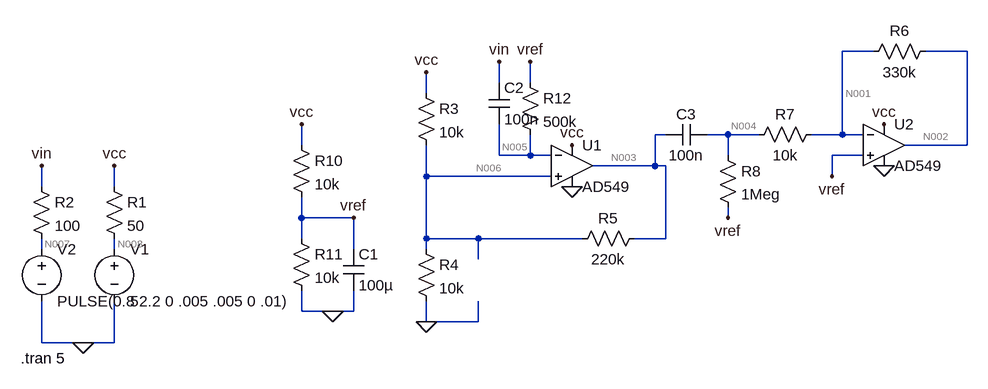
[diagram p0: schematic smith-trig.asc]
smith-trig.asc, the LTspice schematic file:
Version 4
SHEET 1 880 680
WIRE 608 -16 560 -16
WIRE 752 -16 688 -16
WIRE 32 32 32 0
WIRE 80 32 80 0
WIRE -80 48 -80 16
WIRE 288 112 272 112
WIRE 384 112 352 112
WIRE 432 112 384 112
WIRE 560 112 560 -16
WIRE 560 112 512 112
WIRE 592 112 560 112
WIRE -272 128 -272 96
WIRE 752 128 752 -16
WIRE 752 128 656 128
WIRE 32 144 32 96
WIRE 80 144 80 112
WIRE 80 144 32 144
WIRE 112 144 80 144
WIRE 384 144 384 112
WIRE 592 144 544 144
WIRE 272 160 272 112
WIRE 272 160 176 160
WIRE 288 160 272 160
WIRE -80 176 -80 128
WIRE 112 176 -80 176
WIRE 544 176 544 144
WIRE -672 192 -672 160
WIRE -560 192 -560 160
WIRE -272 240 -272 208
WIRE -192 240 -272 240
WIRE 384 240 384 224
WIRE -272 272 -272 240
WIRE -80 272 -80 176
WIRE 0 272 -80 272
WIRE 160 272 0 272
WIRE 288 272 288 160
WIRE 288 272 240 272
WIRE -672 288 -672 272
WIRE -560 288 -560 272
WIRE -192 288 -192 240
WIRE -80 288 -80 272
WIRE 0 304 0 272
WIRE -272 384 -272 352
WIRE -224 384 -272 384
WIRE -192 384 -192 352
WIRE -192 384 -224 384
WIRE -80 400 -80 368
WIRE 0 400 0 368
WIRE 0 400 -80 400
WIRE -672 432 -672 368
WIRE -608 432 -672 432
WIRE -560 432 -560 368
WIRE -560 432 -608 432
FLAG -608 432 0
FLAG 144 192 0
FLAG -560 160 vcc
FLAG 144 128 vcc
FLAG -80 16 vcc
FLAG -80 400 0
FLAG -672 160 vin
FLAG 32 0 vin
FLAG 624 96 vcc
FLAG 624 160 0
FLAG -224 384 0
FLAG -272 96 vcc
FLAG -192 240 vref
FLAG 80 0 vref
FLAG 544 176 vref
FLAG 384 240 vref
SYMBOL OpAmps\\AD549 144 96 R0
SYMATTR InstName U1
SYMBOL voltage -560 272 R0
WINDOW 123 0 0 Left 0
WINDOW 39 0 0 Left 0
SYMATTR InstName V1
SYMATTR Value 5
SYMBOL res -576 176 R0
SYMATTR InstName R1
SYMATTR Value 50
SYMBOL voltage -672 272 R0
WINDOW 123 0 0 Left 0
WINDOW 39 0 0 Left 0
SYMATTR InstName V2
SYMATTR Value PULSE(0.8 2.2 0 .005 .005 0 .01)
SYMBOL res -688 176 R0
SYMATTR InstName R2
SYMATTR Value 100
SYMBOL res -96 32 R0
SYMATTR InstName R3
SYMATTR Value 10k
SYMBOL res -96 272 R0
SYMATTR InstName R4
SYMATTR Value 10k
SYMBOL res 256 256 R90
WINDOW 0 0 56 VBottom 2
WINDOW 3 32 56 VTop 2
SYMATTR InstName R5
SYMATTR Value 220k
SYMBOL OpAmps\\AD549 624 64 R0
SYMATTR InstName U2
SYMBOL res 704 -32 R90
WINDOW 0 0 56 VBottom 2
WINDOW 3 32 56 VTop 2
SYMATTR InstName R6
SYMATTR Value 330k
SYMBOL res 528 96 R90
WINDOW 0 0 56 VBottom 2
WINDOW 3 32 56 VTop 2
SYMATTR InstName R7
SYMATTR Value 10k
SYMBOL res -288 112 R0
SYMATTR InstName R10
SYMATTR Value 10k
SYMBOL res -288 256 R0
SYMATTR InstName R11
SYMATTR Value 10k
SYMBOL cap -208 288 R0
SYMATTR InstName C1
SYMATTR Value 100µ
SYMBOL cap 16 32 R0
SYMATTR InstName C2
SYMATTR Value 100n
SYMBOL res 64 16 R0
SYMATTR InstName R12
SYMATTR Value 500k
SYMBOL res 368 128 R0
SYMATTR InstName R8
SYMATTR Value 1Meg
SYMBOL cap 352 96 R90
WINDOW 0 0 32 VBottom 2
WINDOW 3 32 32 VTop 2
SYMATTR InstName C3
SYMATTR Value 100n
TEXT -704 456 Left 2 !.tran 5

The netlist it stands for:
* smith-trig.asc
XU1 N006 N005 vcc 0 N003 AD549  ; pins In+ In- V+ V- OUT
V1 N008 0 5
R1 vcc N008 50
V2 N007 0 PULSE(0.8 2.2 0 .005 .005 0 .01)
R2 vin N007 100
R3 vcc N006 10k
R4 N006 0 10k
R5 N003 N006 220k
XU2 vref N001 vcc 0 N002 AD549  ; pins In+ In- V+ V- OUT
R6 N002 N001 330k
R7 N001 N004 10k
R10 vcc vref 10k
R11 vref 0 10k
C1 vref 0 100µ
C2 vin N005 100n
R12 vref N005 500k
R8 N004 vref 1Meg
C3 N004 N003 100n
.tran 5
.backanno
.end

* Results of the author's LTspice run, read from the files saved beside the schematic
* Operating Point, zero values left out:
*   V(n005) = 2.448 V
*   V(n006) = 2.413 V
*   V(vcc) = 4.896 V
*   V(n003) = 870.6 mV
*   V(n008) = 5 V
*   V(n007) = 800 mV
*   V(vin) = 800 mV
*   V(n001) = 2.448 V
*   V(vref) = 2.448 V
*   V(n002) = 2.448 V
*   V(n004) = 2.448 V
*   I(R1) = -2.077 mA
*   I(R3) = 248.3 µA
*   I(R4) = 241.3 µA
*   I(R5) = -7.011 µA
*   I(R6) = 296.1 pA
*   I(R7) = 296.1 pA
*   I(R10) = 244.8 µA
*   I(R11) = 244.8 µA
*   I(R8) = 296.1 pA
*   I(V1) = -2.077 mA
*   Ix(u1:3) = 789.6 µA
*   Ix(u1:4) = -796.6 µA
*   Ix(u1:5) = 7.011 µA
*   Ix(u2:3) = 794.4 µA
*   Ix(u2:4) = -794.4 µA
*   Ix(u2:5) = -296.1 pA